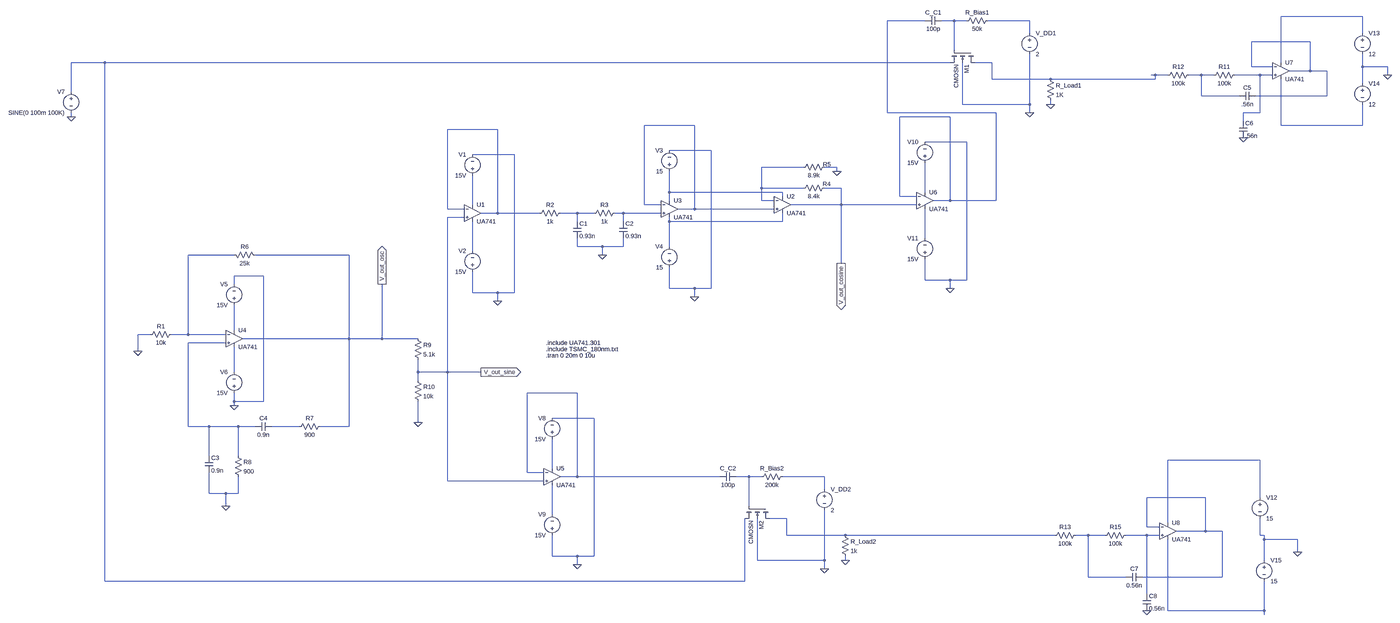
[diagram p0: schematic quadrature-down-converter.asc, whole sheet]
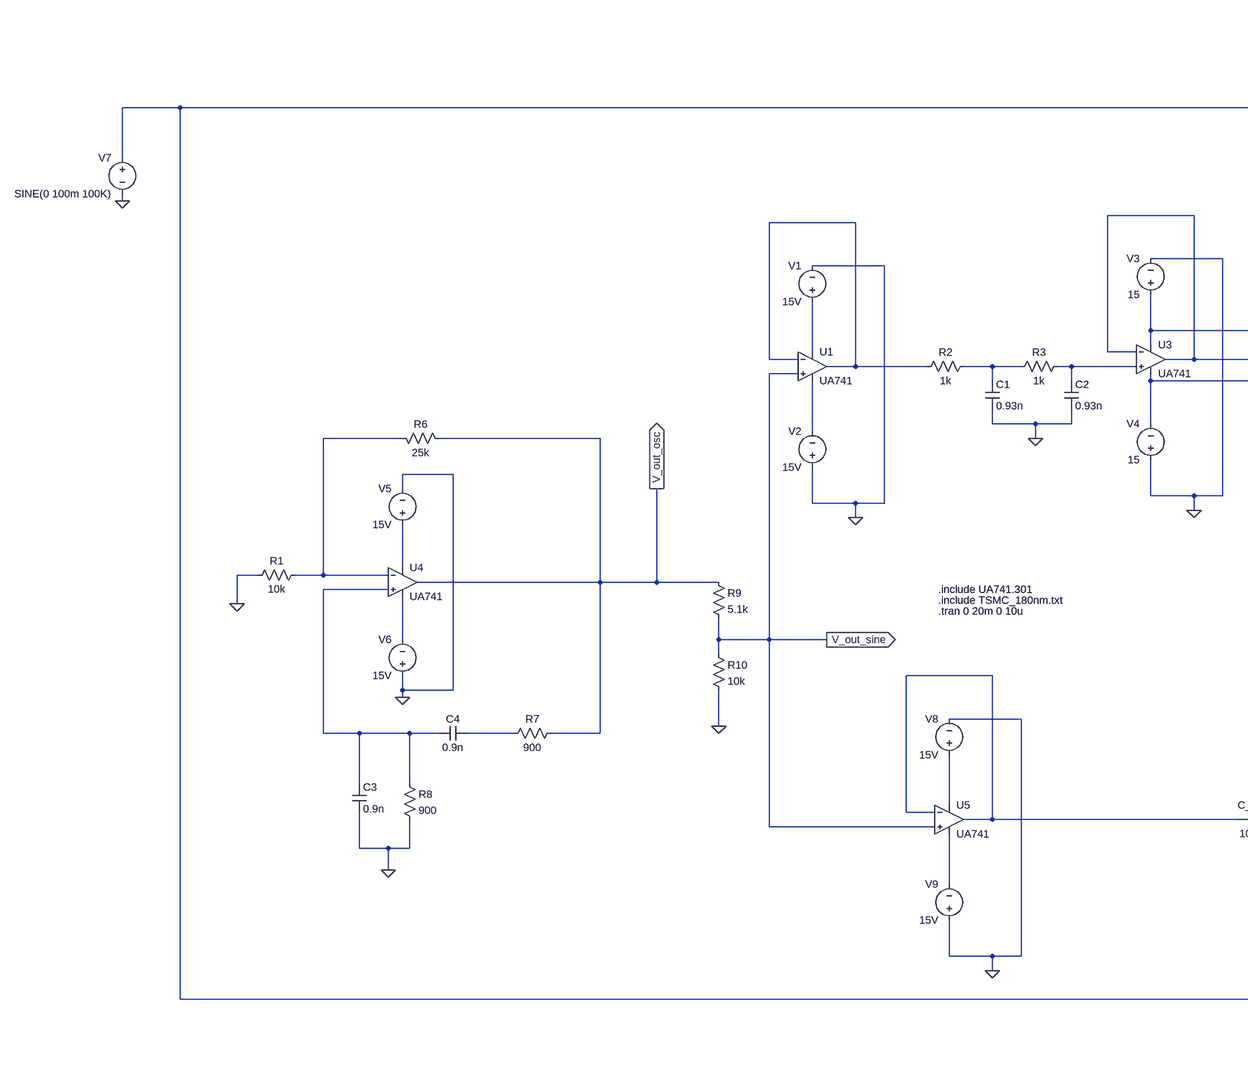
[diagram p1: schematic quadrature-down-converter.asc, part, row 1 of 1, column 1 of 2]
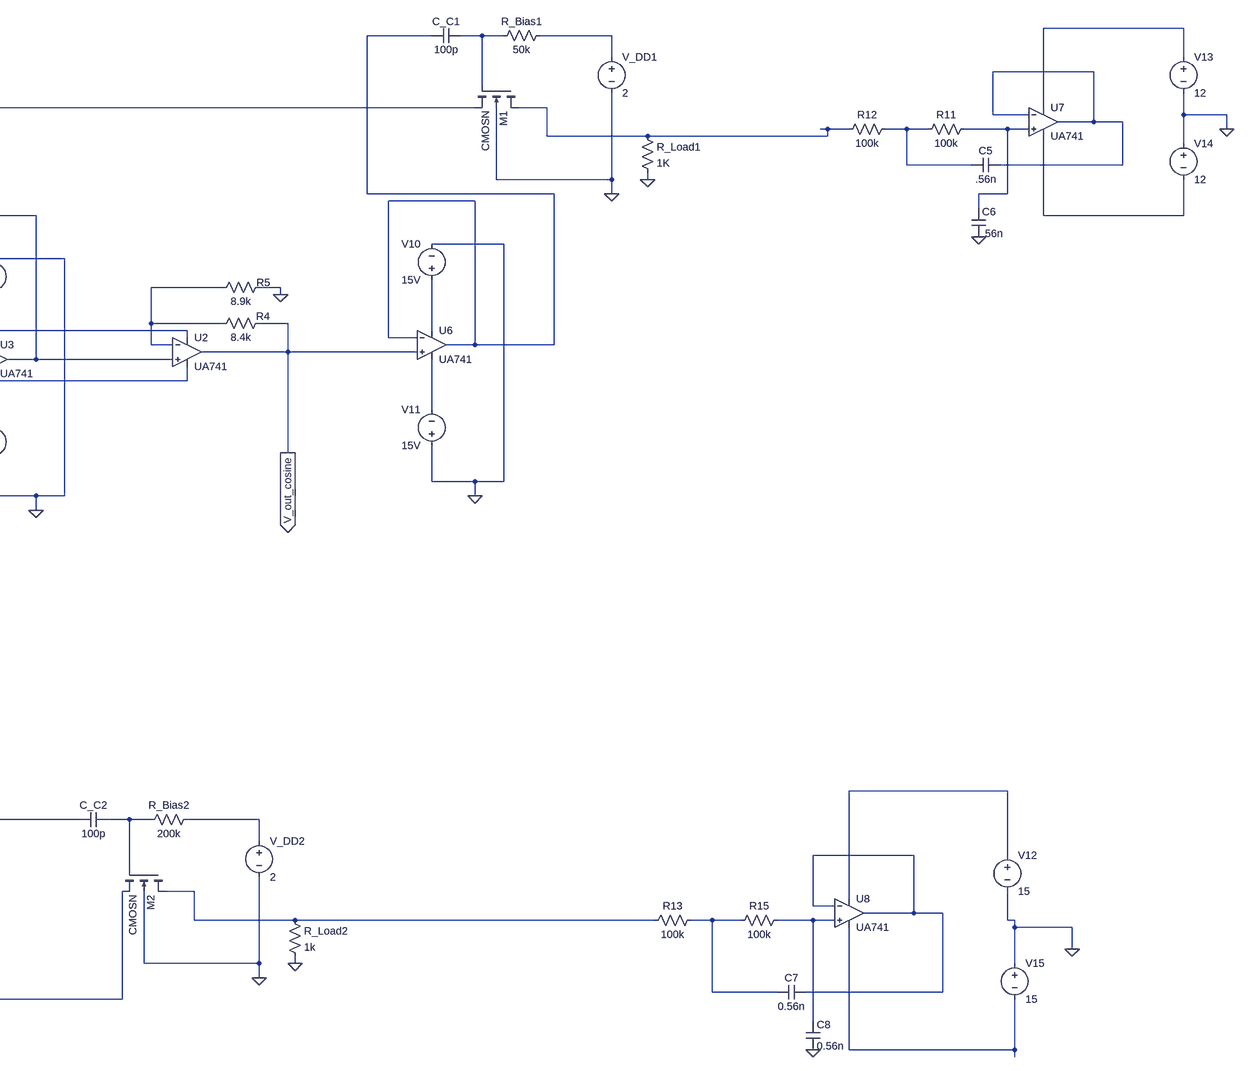
[diagram p2: schematic quadrature-down-converter.asc, part, row 1 of 1, column 2 of 2]
quadrature-down-converter.asc, the LTspice schematic file:
Version 4.1
SHEET 1 3972 2068
WIRE 2912 -336 2592 -336
WIRE 1232 -320 1088 -320
WIRE 1344 -320 1296 -320
WIRE 1392 -320 1344 -320
WIRE 1632 -320 1472 -320
WIRE 1632 -272 1632 -320
WIRE 2912 -272 2912 -336
WIRE 2704 -240 2480 -240
WIRE 1344 -208 1344 -320
WIRE -2288 -160 -2416 -160
WIRE 1328 -160 -2288 -160
WIRE 1488 -160 1424 -160
WIRE 2592 -160 2592 -336
WIRE 2480 -144 2480 -240
WIRE 2560 -144 2480 -144
WIRE 2912 -144 2912 -192
WIRE 3008 -144 2912 -144
WIRE 2704 -128 2704 -240
WIRE 2704 -128 2624 -128
WIRE 2768 -128 2704 -128
WIRE 2112 -112 2096 -112
WIRE 2160 -112 2112 -112
WIRE 2288 -112 2240 -112
WIRE 2336 -112 2288 -112
WIRE 2512 -112 2416 -112
WIRE 2560 -112 2512 -112
WIRE 3008 -112 3008 -144
WIRE 1488 -96 1488 -160
WIRE 1712 -96 1488 -96
WIRE 2112 -96 2112 -112
WIRE 2112 -96 1712 -96
WIRE 2912 -80 2912 -144
WIRE -2416 -48 -2416 -160
WIRE 2288 -32 2288 -112
WIRE 2432 -32 2288 -32
WIRE 2768 -32 2768 -128
WIRE 2768 -32 2496 -32
WIRE 1376 0 1376 -160
WIRE 1632 0 1632 -192
WIRE 1632 0 1376 0
WIRE 1712 0 1712 -16
WIRE 1088 32 1088 -320
WIRE 1504 32 1088 32
WIRE 1632 32 1632 0
WIRE 2512 32 2512 -112
WIRE 2512 32 2448 32
WIRE -2416 48 -2416 32
WIRE 1328 48 1136 48
WIRE 2448 64 2448 32
WIRE 352 80 160 80
WIRE 2592 80 2592 -96
WIRE 2912 80 2912 0
WIRE 2912 80 2592 80
WIRE -400 96 -592 96
WIRE 1392 144 1232 144
WIRE 416 176 256 176
WIRE -336 192 -496 192
WIRE 768 240 608 240
WIRE 896 240 848 240
WIRE 896 256 896 240
WIRE 608 320 608 240
WIRE 768 320 608 320
WIRE 912 320 848 320
WIRE 256 336 256 256
WIRE 688 336 256 336
WIRE 1232 336 1232 224
WIRE 688 352 688 336
WIRE 1136 352 1136 48
WIRE 1200 352 1136 352
WIRE 256 368 256 336
WIRE 608 368 608 320
WIRE 656 368 608 368
WIRE 1328 368 1328 48
WIRE 1328 368 1264 368
WIRE 1504 368 1504 32
WIRE 1504 368 1328 368
WIRE -496 384 -496 272
WIRE 160 384 160 80
WIRE 224 384 160 384
WIRE 912 384 912 320
WIRE 912 384 720 384
WIRE 1200 384 912 384
WIRE -592 400 -592 96
WIRE -528 400 -592 400
WIRE 352 400 352 80
WIRE 352 400 288 400
WIRE 656 400 352 400
WIRE -400 416 -400 96
WIRE -400 416 -464 416
WIRE -240 416 -400 416
WIRE -96 416 -160 416
WIRE -32 416 -96 416
WIRE 80 416 48 416
WIRE 224 416 80 416
WIRE -528 432 -592 432
WIRE -96 448 -96 416
WIRE 80 448 80 416
WIRE 256 448 256 432
WIRE 688 448 688 416
WIRE 688 448 256 448
WIRE 1232 512 1232 400
WIRE -96 544 -96 512
WIRE 0 544 -96 544
WIRE 80 544 80 512
WIRE 80 544 0 544
WIRE 256 544 256 448
WIRE -496 560 -496 448
WIRE -1520 576 -1696 576
WIRE -1056 576 -1440 576
WIRE 0 576 0 544
WIRE 912 608 912 384
WIRE -1408 656 -1520 656
WIRE 1232 672 1232 592
WIRE 1328 672 1232 672
WIRE 1392 672 1392 144
WIRE 1392 672 1328 672
WIRE -1520 688 -1520 656
WIRE 256 704 256 624
WIRE 352 704 256 704
WIRE 416 704 416 176
WIRE 416 704 352 704
WIRE 1328 704 1328 672
WIRE -496 720 -496 640
WIRE -400 720 -496 720
WIRE -336 720 -336 192
WIRE -336 720 -400 720
WIRE 352 736 352 704
WIRE -400 752 -400 720
WIRE -1520 864 -1520 768
WIRE -1840 880 -1888 880
WIRE -1696 880 -1696 576
WIRE -1696 880 -1760 880
WIRE -1552 880 -1696 880
WIRE -1056 896 -1056 576
WIRE -1056 896 -1488 896
WIRE -912 896 -912 688
WIRE -912 896 -1056 896
WIRE -704 896 -912 896
WIRE -1552 912 -1696 912
WIRE -1888 944 -1888 880
WIRE -1520 1024 -1520 928
WIRE -704 1024 -704 976
WIRE -592 1024 -592 432
WIRE -592 1024 -704 1024
WIRE -464 1024 -592 1024
WIRE -704 1056 -704 1024
WIRE -96 1104 -288 1104
WIRE -1520 1136 -1520 1104
WIRE -1408 1136 -1408 656
WIRE -1408 1136 -1520 1136
WIRE -1520 1152 -1520 1136
WIRE -32 1200 -192 1200
WIRE -704 1216 -704 1136
WIRE -1696 1232 -1696 912
WIRE -1616 1232 -1696 1232
WIRE -1504 1232 -1616 1232
WIRE -1440 1232 -1504 1232
WIRE -1248 1232 -1376 1232
WIRE -1056 1232 -1056 896
WIRE -1056 1232 -1168 1232
WIRE -1616 1344 -1616 1232
WIRE -1504 1344 -1504 1232
WIRE 2512 1360 2160 1360
WIRE -192 1392 -192 1280
WIRE -288 1408 -288 1104
WIRE -224 1408 -288 1408
WIRE -96 1424 -96 1104
WIRE -96 1424 -160 1424
WIRE 448 1424 -96 1424
WIRE 560 1424 512 1424
WIRE 608 1424 560 1424
WIRE 848 1424 688 1424
WIRE -592 1440 -592 1024
WIRE -224 1440 -592 1440
WIRE 848 1472 848 1424
WIRE -1616 1488 -1616 1408
WIRE -1552 1488 -1616 1488
WIRE -1504 1488 -1504 1424
WIRE -1504 1488 -1552 1488
WIRE 2304 1504 2080 1504
WIRE 2512 1504 2512 1360
WIRE -1552 1536 -1552 1488
WIRE 560 1536 560 1424
WIRE -192 1568 -192 1456
WIRE 704 1584 640 1584
WIRE 2160 1600 2160 1360
WIRE 2080 1616 2080 1504
WIRE 2128 1616 2080 1616
WIRE 2304 1632 2304 1504
WIRE 2304 1632 2192 1632
WIRE 2368 1632 2304 1632
WIRE 704 1648 704 1584
WIRE 928 1648 704 1648
WIRE 1728 1648 928 1648
WIRE 1856 1648 1808 1648
WIRE 1920 1648 1856 1648
WIRE 2080 1648 2000 1648
WIRE 2128 1648 2080 1648
WIRE 2512 1648 2512 1584
WIRE 2528 1648 2512 1648
WIRE 2528 1664 2528 1648
WIRE 2656 1664 2528 1664
WIRE 2656 1712 2656 1664
WIRE -192 1728 -192 1648
WIRE -96 1728 -192 1728
WIRE -32 1728 -32 1200
WIRE -32 1728 -96 1728
WIRE 592 1744 592 1584
WIRE 848 1744 848 1552
WIRE 848 1744 592 1744
WIRE 928 1744 928 1728
WIRE 2528 1744 2528 1664
WIRE -96 1760 -96 1728
WIRE 848 1776 848 1744
WIRE 1856 1808 1856 1648
WIRE 2000 1808 1856 1808
WIRE 2368 1808 2368 1632
WIRE 2368 1808 2064 1808
WIRE -2288 1824 -2288 -160
WIRE 544 1824 544 1584
WIRE 544 1824 -2288 1824
WIRE 2080 1872 2080 1648
WIRE 2160 1936 2160 1664
WIRE 2528 1936 2528 1824
WIRE 2528 1936 2160 1936
WIRE 2528 1952 2528 1936
FLAG 1632 32 0
FLAG 1712 0 0
FLAG 848 1776 0
FLAG 928 1744 0
FLAG -400 752 0
FLAG 352 736 0
FLAG 0 576 0
FLAG 896 256 0
FLAG 912 608 V_out_cosine
IOPIN 912 608 Out
FLAG -1520 1152 0
FLAG -704 1216 0
FLAG -464 1024 V_out_sine
IOPIN -464 1024 Out
FLAG -1552 1536 0
FLAG -912 688 V_out_osc
IOPIN -912 688 Out
FLAG -1888 944 0
FLAG -2416 48 0
FLAG -96 1760 0
FLAG 1328 704 0
FLAG 2448 128 0
FLAG 3008 -112 0
FLAG 2080 1936 0
FLAG 2656 1712 0
SYMBOL res 1376 -304 R270
WINDOW 0 32 56 VTop 2
WINDOW 3 0 56 VBottom 2
SYMATTR InstName R_Bias1
SYMATTR Value 50k
SYMBOL cap 1296 -336 R90
WINDOW 0 0 32 VBottom 2
WINDOW 3 32 32 VTop 2
SYMATTR InstName C_C1
SYMATTR Value 100p
SYMBOL voltage 1632 -288 R0
WINDOW 123 0 0 Left 0
WINDOW 39 0 0 Left 0
SYMATTR InstName V_DD1
SYMATTR Value 2
SYMBOL res 1696 -112 R0
SYMATTR InstName R_Load1
SYMATTR Value 1K
SYMBOL nmos4 1424 -208 R90
SYMATTR InstName M1
SYMATTR Value CMOSN
SYMATTR Value2 l=0.18u w=2u  AD=0.36p AS=0.36p PD=4.36u PS=4.36u
SYMBOL res 592 1440 R270
WINDOW 0 32 56 VTop 2
WINDOW 3 0 56 VBottom 2
SYMATTR InstName R_Bias2
SYMATTR Value 200k
SYMBOL cap 512 1408 R90
WINDOW 0 0 32 VBottom 2
WINDOW 3 32 32 VTop 2
SYMATTR InstName C_C2
SYMATTR Value 100p
SYMBOL voltage 848 1456 R0
WINDOW 123 0 0 Left 0
WINDOW 39 0 0 Left 0
SYMATTR InstName V_DD2
SYMATTR Value 2
SYMBOL res 912 1632 R0
SYMATTR InstName R_Load2
SYMATTR Value 1k
SYMBOL nmos4 640 1536 R90
SYMATTR InstName M2
SYMATTR Value CMOSN
SYMATTR Value2 l=0.18u w=2u  AD=0.36p AS=0.36p PD=4.36u PS=4.36u
SYMBOL res -1744 864 R90
WINDOW 0 0 56 VBottom 2
WINDOW 3 32 56 VTop 2
SYMATTR InstName R1
SYMATTR Value 10k
SYMBOL OpAmps\\opamp2 -496 352 R0
SYMATTR InstName U1
SYMATTR Value UA741
SYMBOL voltage -496 288 R180
WINDOW 0 24 96 Left 2
WINDOW 3 24 16 Left 2
SYMATTR InstName V1
SYMATTR Value 15V
SYMBOL voltage -496 656 R180
WINDOW 0 24 96 Left 2
WINDOW 3 24 16 Left 2
SYMATTR InstName V2
SYMATTR Value 15V
SYMBOL res -144 400 R90
WINDOW 0 0 56 VBottom 2
WINDOW 3 32 56 VTop 2
SYMATTR InstName R2
SYMATTR Value 1k
SYMBOL res 64 400 R90
WINDOW 0 0 56 VBottom 2
WINDOW 3 32 56 VTop 2
SYMATTR InstName R3
SYMATTR Value 1k
SYMBOL voltage 256 272 R180
WINDOW 0 24 96 Left 2
WINDOW 3 24 16 Left 2
WINDOW 123 0 0 Left 0
WINDOW 39 0 0 Left 0
SYMATTR InstName V3
SYMATTR Value 15
SYMBOL voltage 256 640 R180
WINDOW 0 24 96 Left 2
WINDOW 3 24 16 Left 2
WINDOW 123 0 0 Left 0
WINDOW 39 0 0 Left 0
SYMATTR InstName V4
SYMATTR Value 15
SYMBOL OpAmps\\opamp2 688 320 R0
SYMATTR InstName U2
SYMATTR Value UA741
SYMBOL OpAmps\\opamp2 256 336 R0
SYMATTR InstName U3
SYMATTR Value UA741
SYMBOL cap -112 448 R0
SYMATTR InstName C1
SYMATTR Value 0.93n
SYMBOL cap 64 448 R0
SYMATTR InstName C2
SYMATTR Value 0.93n
SYMBOL res 864 304 R90
WINDOW 0 16 7 VBottom 2
WINDOW 3 32 56 VTop 2
SYMATTR InstName R4
SYMATTR Value 8.4k
SYMBOL res 864 224 R90
WINDOW 0 21 6 VBottom 2
WINDOW 3 32 56 VTop 2
SYMATTR InstName R5
SYMATTR Value 8.9k
SYMBOL OpAmps\\opamp2 -1520 832 R0
SYMATTR InstName U4
SYMATTR Value UA741
SYMBOL voltage -1520 784 R180
WINDOW 0 24 96 Left 2
WINDOW 3 24 16 Left 2
SYMATTR InstName V5
SYMATTR Value 15V
SYMBOL res -1536 560 M90
WINDOW 0 0 56 VBottom 2
WINDOW 3 32 56 VTop 2
SYMATTR InstName R6
SYMATTR Value 25k
SYMBOL res -1152 1216 R90
WINDOW 0 0 56 VBottom 2
WINDOW 3 32 56 VTop 2
SYMATTR InstName R7
SYMATTR Value 900
SYMBOL cap -1632 1344 R0
SYMATTR InstName C3
SYMATTR Value 0.9n
SYMBOL res -1520 1328 R0
SYMATTR InstName R8
SYMATTR Value 900
SYMBOL cap -1376 1216 R90
WINDOW 0 0 32 VBottom 2
WINDOW 3 32 32 VTop 2
SYMATTR InstName C4
SYMATTR Value 0.9n
SYMBOL voltage -1520 1120 R180
WINDOW 0 24 96 Left 2
WINDOW 3 24 16 Left 2
SYMATTR InstName V6
SYMATTR Value 15V
SYMBOL res -720 880 R0
SYMATTR InstName R9
SYMATTR Value 5.1k
SYMBOL res -720 1040 R0
SYMATTR InstName R10
SYMATTR Value 10k
SYMBOL voltage -2416 -64 M0
WINDOW 123 0 0 Left 0
WINDOW 39 0 0 Left 0
SYMATTR InstName V7
SYMATTR Value SINE(0 100m 100K)
SYMBOL OpAmps\\opamp2 -192 1360 R0
SYMATTR InstName U5
SYMATTR Value UA741
SYMBOL voltage -192 1296 R180
WINDOW 0 24 96 Left 2
WINDOW 3 24 16 Left 2
SYMATTR InstName V8
SYMATTR Value 15V
SYMBOL voltage -192 1664 R180
WINDOW 0 24 96 Left 2
WINDOW 3 24 16 Left 2
SYMATTR InstName V9
SYMATTR Value 15V
SYMBOL OpAmps\\opamp2 1232 304 R0
SYMATTR InstName U6
SYMATTR Value UA741
SYMBOL voltage 1232 240 R180
WINDOW 0 24 96 Left 2
WINDOW 3 24 16 Left 2
SYMATTR InstName V10
SYMATTR Value 15V
SYMBOL voltage 1232 608 R180
WINDOW 0 24 96 Left 2
WINDOW 3 24 16 Left 2
SYMATTR InstName V11
SYMATTR Value 15V
SYMBOL res 2432 -128 R90
WINDOW 0 0 56 VBottom 2
WINDOW 3 32 56 VTop 2
SYMATTR InstName R11
SYMATTR Value 100k
SYMBOL res 2256 -128 R90
WINDOW 0 0 56 VBottom 2
WINDOW 3 32 56 VTop 2
SYMATTR InstName R12
SYMATTR Value 100k
SYMBOL cap 2496 -48 R90
WINDOW 0 0 32 VBottom 2
WINDOW 3 32 32 VTop 2
SYMATTR InstName C5
SYMATTR Value .56n
SYMBOL cap 2432 64 R0
SYMATTR InstName C6
SYMATTR Value .56n
SYMBOL voltage 2912 -288 R0
WINDOW 123 0 0 Left 0
WINDOW 39 0 0 Left 0
SYMATTR InstName V13
SYMATTR Value 12
SYMBOL voltage 2912 -96 R0
WINDOW 123 0 0 Left 0
WINDOW 39 0 0 Left 0
SYMATTR InstName V14
SYMATTR Value 12
SYMBOL res 1824 1632 R90
WINDOW 0 0 56 VBottom 2
WINDOW 3 32 56 VTop 2
SYMATTR InstName R13
SYMATTR Value 100k
SYMBOL res 2016 1632 R90
WINDOW 0 0 56 VBottom 2
WINDOW 3 32 56 VTop 2
SYMATTR InstName R15
SYMATTR Value 100k
SYMBOL OpAmps\\opamp2 2160 1568 R0
SYMATTR InstName U8
SYMATTR Value UA741
SYMBOL cap 2064 1792 R90
WINDOW 0 0 32 VBottom 2
WINDOW 3 32 32 VTop 2
SYMATTR InstName C7
SYMATTR Value 0.56n
SYMBOL cap 2064 1872 R0
SYMATTR InstName C8
SYMATTR Value 0.56n
SYMBOL voltage 2512 1488 R0
WINDOW 123 0 0 Left 0
WINDOW 39 0 0 Left 0
SYMATTR InstName V12
SYMATTR Value 15
SYMBOL voltage 2528 1728 R0
WINDOW 123 0 0 Left 0
WINDOW 39 0 0 Left 0
SYMATTR InstName V15
SYMATTR Value 15
SYMBOL OpAmps\\opamp2 2592 -192 R0
SYMATTR InstName U7
SYMATTR Value UA741
TEXT -216 912 Left 2 !.include UA741.301
TEXT -216 936 Left 2 !.include TSMC_180nm.txt
TEXT -216 960 Left 2 !.tran 0 20m 0 10u

The netlist it stands for:
* quadrature-down-converter.asc
R_Bias1 N003 N004 50k
C_C1 N003 N002 100p
V_DD1 N004 0 2
R_Load1 N007 0 1K
M1 N007 N003 N006 0 CMOSN l=0.18u w=2u  AD=0.36p AS=0.36p PD=4.36u PS=4.36u
R_Bias2 N030 N031 200k
C_C2 N030 N026 100p
V_DD2 N031 0 2
R_Load2 N034 0 1k
M2 N034 N030 N006 0 CMOSN l=0.18u w=2u  AD=0.36p AS=0.36p PD=4.36u PS=4.36u
R1 N022 0 10k
X§U1 V_out_sine N012 N016 N021 N012 UA741  ; pins In+ In- V+ V- OUT
V1 N016 0 15V
V2 0 N021 15V
R2 N017 N012 1k
R3 N018 N017 1k
V3 N014 0 15
V4 0 N019 15
X§U2 N010 N013 N014 N019 V_out_cosine UA741  ; pins In+ In- V+ V- OUT
X§U3 N018 N010 N014 N019 N010 UA741  ; pins In+ In- V+ V- OUT
C1 N017 0 0.93n
C2 N018 0 0.93n
R4 V_out_cosine N013 8.4k
R5 0 N013 8.9k
X§U4 N024 N022 N023 N025 V_out_osc UA741  ; pins In+ In- V+ V- OUT
V5 N023 0 15V
R6 N022 V_out_osc 25k
R7 V_out_osc N027 900
C3 N024 0 0.9n
R8 N024 0 900
C4 N027 N024 0.9n
V6 0 N025 15V
R9 V_out_osc V_out_sine 5.1k
R10 V_out_sine 0 10k
V7 N006 0 SINE(0 100m 100K)
X§U5 V_out_sine N026 N029 N033 N026 UA741  ; pins In+ In- V+ V- OUT
V8 N029 0 15V
V9 0 N033 15V
X§U6 V_out_cosine N002 N015 N020 N002 UA741  ; pins In+ In- V+ V- OUT
V10 N015 0 15V
V11 0 N020 15V
R11 N009 N008 100k
R12 N008 N007 100k
C5 N005 N008 .56n
C6 N009 0 .56n
V13 N001 0 12
V14 0 N011 12
R13 N035 N034 100k
R15 N036 N035 100k
X§U8 N036 N032 N028 N037 N032 UA741  ; pins In+ In- V+ V- OUT
C7 N032 N035 0.56n
C8 N036 0 0.56n
V12 N028 0 15
V15 0 N037 15
X§U7 N009 N005 N001 N011 N005 UA741  ; pins In+ In- V+ V- OUT
.model NMOS NMOS
.model PMOS PMOS
.lib standard.mos
.include UA741.301
.include TSMC_180nm.txt
.tran 0 20m 0 10u
.backanno
.end